# Altium project lv_io_project.PrjPCB (part 2 of 2)

## Sheet lv_io_lim.SchDoc
size A4; Organization: Badgerloop; Address1: 133 Engineering Research; Address2: Building; Address3: Madison, WI 53715
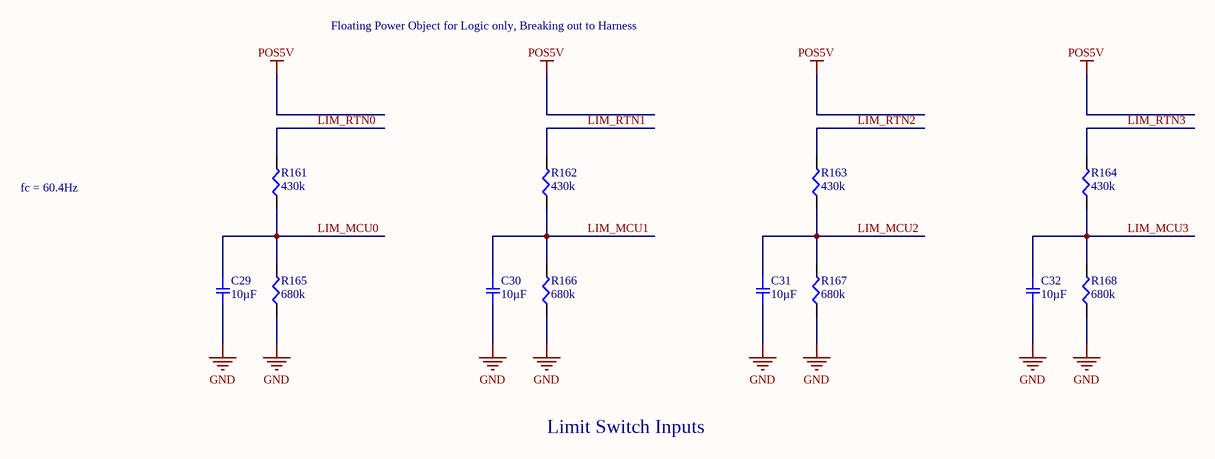
[diagram p8: lv_io_lim.SchDoc]

### Parts
C29  10µF  [SMD-0805C]
C30  10µF  [SMD-0805C]
C31  10µF  [SMD-0805C]
C32  10µF  [SMD-0805C]
R161  430k  [SMD-0402-RES]
R162  430k  [SMD-0402-RES]
R163  430k  [SMD-0402-RES]
R164  430k  [SMD-0402-RES]
R165  680k  [SMD-0402-RES]
R166  680k  [SMD-0402-RES]
R167  680k  [SMD-0402-RES]
R168  680k  [SMD-0402-RES]

### Nets
GND: C29.2 C30.2 C31.2 C32.2 R165.1 R166.1 R167.1 R168.1
LIM_MCU0: C29.1 R161.1 R165.2
LIM_MCU1: C30.1 R162.1 R166.2
LIM_MCU2: C31.1 R163.1 R167.2
LIM_MCU3: C32.1 R164.1 R168.2
LIM_RTN0: R161.2
LIM_RTN1: R162.2
LIM_RTN2: R163.2
LIM_RTN3: R164.2

### Notes on the sheet
- Floating Power Object for Logic only, Breaking out to Harness
- fc = 60.4Hz
- Limit Switch Inputs
- Title
- Size:
- Date:
- A4
- Number:
- Time:
- Revision:
- Sheet
- of
- File:

### Library data of the parts
C29-C32 = GRM21BC81E106KE51L: CAP CER 10UF 25V X6S 0805; Manufacturer: Murata Electronics North America; Factory Stock: 0; Unit Price (USD): 0.25; Minimum Quantity: 1; Tolerance: ±10%; Datasheets: http://www.murata.com/~/media/webrenewal/support/library/catalog/products/capacitor/mlcc/c02e.pdf; Image: //media.digikey.com/Renders/Murata%20Renders/0805%20(2012%20Metric)%20.85mm.jpg; Digi-Key Part Number: 490-10502-1-ND; Part Number: GRM21BC81E106KE51L; Quantity Available: 230; @ qty: 0; Packaging: Cut Tape (CT); Series: GRM; Part Status: Active; Value: 10µF; Voltage: 25V; Temperature Coefficient: X6S; Operating Temperature: -55°C ~ 105°C; Features: Derating Recommended; Ratings: -; Applications: General Purpose; Mounting Type: Surface Mount, MLCC; Package / Case: 0805 (2012 Metric); Size / Dimension: 0.079" L x 0.049" W (2.00mm x 1.25mm); Height - Seated (Max): -; Thickness (Max): 0.055" (1.40mm); Lead Spacing: -; Lead Style: -
R161-R164 = ERJ-2GEJ434X: RES SMD 430K OHM 5% 1/10W 0402; Manufacturer: Panasonic Electronic Components; Factory Stock: 0; Unit Price (USD): 0.00350; @ qty: 1500; Minimum Quantity: 1; Power (Watts): 0.1W, 1/10W; Temperature Coefficient: ±200ppm/°C; Part Number: ERJ-2GEJ434X; Datasheets: http://industrial.panasonic.com/www-cgi/jvcr13pz.cgi?E+PZ+3+AOA0001+ERJ2GEJ434X+7+WW; Image: //media.digikey.com/Photos/Panasonic%20Photos/ERJ-PA2-Series.jpg; Digi-Key Part Number: P430KJCT-ND; Quantity Available: 99138; Packaging: Cut Tape (CT); Series: ERJ; Part Status: Active; Value: 430k; Tolerance: ±5%; Composition: Thick Film; Features: Automotive AEC-Q200; Operating Temperature: -55°C ~ 155°C; Package / Case: 0402 (1005 Metric); Supplier Device Package: 0402; Size / Dimension: 0.039" L x 0.020" W (1.00mm x 0.50mm); Height - Seated (Max): 0.016" (0.40mm); Number of Terminations: 2; Failure Rate: -
R165-R168 = ERJ-2GEJ684X: RES SMD 680K OHM 5% 1/10W 0402; Manufacturer: Panasonic Electronic Components; Factory Stock: 0; Unit Price (USD): 0.00350; @ qty: 1500; Minimum Quantity: 1; Power (Watts): 0.1W, 1/10W; Temperature Coefficient: ±200ppm/°C; Part Number: ERJ-2GEJ684X; Datasheets: http://industrial.panasonic.com/www-cgi/jvcr13pz.cgi?E+PZ+3+AOA0001+ERJ2GEJ684X+7+WW; Image: //media.digikey.com/Photos/Panasonic%20Photos/ERJ-PA2-Series.jpg; Digi-Key Part Number: P680KJCT-ND; Quantity Available: 77606; Packaging: Cut Tape (CT); Series: ERJ; Part Status: Active; Value: 680k; Tolerance: ±5%; Composition: Thick Film; Features: Automotive AEC-Q200; Operating Temperature: -55°C ~ 155°C; Package / Case: 0402 (1005 Metric); Supplier Device Package: 0402; Size / Dimension: 0.039" L x 0.020" W (1.00mm x 0.50mm); Height - Seated (Max): 0.016" (0.40mm); Number of Terminations: 2; Failure Rate: -

## Nets that join several sheets
GND: lv_io_main_connector (23 pins), lv_io_accel (23 pins), lv_io_harness (36 pins), lv_io_retro (7 pins), lv_io_pressure (13 pins), lv_io_solenoid_ctl (13 pins), lv_io_solenoid_drv (16 pins), lv_io_analog_input (21 pins), lv_io_lim (8 pins)
POS3V3: lv_io_main_connector (12 pins), lv_io_accel (12 pins), lv_io_retro (12 pins)
POS5V: lv_io_main_connector (6 pins), lv_io_accel (C1.1 P1.1), lv_io_harness (5 pins), lv_io_pressure (13 pins), lv_io_solenoid_ctl (13 pins), lv_io_analog_input (13 pins)
POS24V: lv_io_harness (19 pins), lv_io_retro (13 pins), lv_io_pressure (8 pins), lv_io_solenoid_drv (9 pins), lv_io_analog_input (8 pins)
ANALOG_HRN_EXC0: lv_io_harness (J2.13), lv_io_analog_input (R113.1 R114.1)
ANALOG_HRN_EXC1: lv_io_harness (J2.25), lv_io_analog_input (R115.1 R116.1)
ANALOG_HRN_EXC2: lv_io_harness (J2.12), lv_io_analog_input (R117.1 R118.1)
ANALOG_HRN_EXC3: lv_io_harness (J2.24), lv_io_analog_input (R119.1 R120.1)
ANALOG_HRN_EXC4: lv_io_harness (J2.11), lv_io_analog_input (R129.1 R130.1)
ANALOG_HRN_EXC5: lv_io_harness (J2.23), lv_io_analog_input (R131.1 R132.1)
ANALOG_HRN_EXC6: lv_io_harness (J2.10), lv_io_analog_input (R133.1 R134.1)
ANALOG_HRN_EXC7: lv_io_harness (J2.22), lv_io_analog_input (R135.1 R136.1)
ANALOG_HRN_IN0: lv_io_harness (J2.9), lv_io_analog_input (R121.1 R189.1)
ANALOG_HRN_IN1: lv_io_harness (J2.21), lv_io_analog_input (R122.1 R190.1)
ANALOG_HRN_IN2: lv_io_harness (J2.8), lv_io_analog_input (R123.1 R191.1)
ANALOG_HRN_IN3: lv_io_harness (J2.20), lv_io_analog_input (R124.1 R192.1)
ANALOG_HRN_IN4: lv_io_harness (J2.7), lv_io_analog_input (R137.1 R197.1)
ANALOG_HRN_IN5: lv_io_harness (J2.19), lv_io_analog_input (R138.1 R198.1)
ANALOG_HRN_IN6: lv_io_harness (J2.6), lv_io_analog_input (R139.1 R199.1)
ANALOG_HRN_IN7: lv_io_harness (J2.18), lv_io_analog_input (R140.1 R200.1)
I2C2_SCL: lv_io_main_connector (J6.4 R26.2), lv_io_accel (R3.1 R16.2 R17.2), lv_io_pressure (R69.1), lv_io_solenoid_ctl (R100.1), lv_io_analog_input (R153.1)
I2C2_SDA: lv_io_main_connector (J6.20 R27.2), lv_io_accel (R4.1 R18.2 R19.2), lv_io_pressure (R66.1), lv_io_solenoid_ctl (R101.1), lv_io_analog_input (R150.1)
LIM_MCU0: lv_io_solenoid_ctl (U11.21), lv_io_lim (C29.1 R161.1 R165.2)
LIM_MCU1: lv_io_solenoid_ctl (U11.22), lv_io_lim (C30.1 R162.1 R166.2)
LIM_MCU2: lv_io_solenoid_ctl (U11.23), lv_io_lim (C31.1 R163.1 R167.2)
LIM_MCU3: lv_io_solenoid_ctl (U11.24), lv_io_lim (C32.1 R164.1 R168.2)
LIM_RTN0: lv_io_harness (J3.1), lv_io_lim (R161.2)
LIM_RTN1: lv_io_harness (J3.14), lv_io_lim (R162.2)
LIM_RTN2: lv_io_harness (J3.2), lv_io_lim (R163.2)
LIM_RTN3: lv_io_harness (J3.15), lv_io_lim (R164.2)
PS_HRN_EXC0: lv_io_harness (J4.13), lv_io_pressure (R29.1 R30.1)
PS_HRN_EXC1: lv_io_harness (J4.25), lv_io_pressure (R31.1 R32.1)
PS_HRN_EXC2: lv_io_harness (J4.12), lv_io_pressure (R33.1 R34.1)
PS_HRN_EXC3: lv_io_harness (J4.24), lv_io_pressure (R35.1 R36.1)
PS_HRN_EXC4: lv_io_harness (J4.11), lv_io_pressure (R45.1 R46.1)
PS_HRN_EXC5: lv_io_harness (J4.23), lv_io_pressure (R47.1 R48.1)
PS_HRN_EXC6: lv_io_harness (J4.10), lv_io_pressure (R49.1 R50.1)
PS_HRN_EXC7: lv_io_harness (J4.22), lv_io_pressure (R51.1 R52.1 R64.2), lv_io_analog_input (R148.2)
PS_HRN_IN0: lv_io_harness (J4.9), lv_io_pressure (R37.1 R173.1)
PS_HRN_IN1: lv_io_harness (J4.21), lv_io_pressure (R38.1 R174.1)
PS_HRN_IN2: lv_io_harness (J4.8), lv_io_pressure (R39.1 R175.1)
PS_HRN_IN3: lv_io_harness (J4.20), lv_io_pressure (R40.1 R176.1)
PS_HRN_IN4: lv_io_harness (J4.7), lv_io_pressure (R53.1 R181.1)
PS_HRN_IN5: lv_io_harness (J4.19), lv_io_pressure (R54.1 R182.1)
PS_HRN_IN6: lv_io_harness (J4.6), lv_io_pressure (R55.1 R183.1)
PS_HRN_IN7: lv_io_harness (J4.18), lv_io_pressure (R56.1 R67.2 R184.1), lv_io_analog_input (R151.2)
RETRO_SIG0: lv_io_harness (J1.23), lv_io_retro (D12.1 U10.2)
RETRO_SIG1: lv_io_harness (J1.11), lv_io_retro (D10.1 U9.2)
RETRO_SIG2: lv_io_harness (J1.24), lv_io_retro (D8.1 U8.2)
RETRO_SIG3: lv_io_harness (J1.12), lv_io_retro (D6.1 U7.2)
RETRO_SIG4: lv_io_harness (J1.25), lv_io_retro (D4.1 U6.2)
RETRO_SIG5: lv_io_harness (J1.13), lv_io_retro (D2.1 R81.2 U5.2)
SOL_GATE0: lv_io_solenoid_ctl (D20.1 D28.2 U11.1), lv_io_solenoid_drv (Q1.1 R105.2)
SOL_GATE1: lv_io_solenoid_ctl (D19.1 D27.2 U11.2), lv_io_solenoid_drv (Q2.1 R106.2)
SOL_GATE2: lv_io_solenoid_ctl (D18.1 D26.2 U11.3), lv_io_solenoid_drv (Q3.1 R107.2)
SOL_GATE3: lv_io_solenoid_ctl (D17.1 D25.2 U11.4), lv_io_solenoid_drv (Q4.1 R108.2)
SOL_GATE4: lv_io_solenoid_ctl (D16.1 D24.2 U11.5), lv_io_solenoid_drv (Q5.1 R109.2)
SOL_GATE5: lv_io_solenoid_ctl (D15.1 D23.2 U11.6), lv_io_solenoid_drv (Q6.1 R110.2)
SOL_GATE6: lv_io_solenoid_ctl (D14.1 D22.2 U11.7), lv_io_solenoid_drv (Q7.1 R111.2)
SOL_GATE7: lv_io_solenoid_ctl (D13.1 D21.2 U11.8), lv_io_solenoid_drv (Q8.1 R112.2)
SOL_RTN0: lv_io_harness (J3.9), lv_io_solenoid_drv (D29.1 Q1.4)
SOL_RTN1: lv_io_harness (J3.21), lv_io_solenoid_drv (D30.1 Q2.4)
SOL_RTN2: lv_io_harness (J3.8), lv_io_solenoid_drv (D31.1 Q3.4)
SOL_RTN3: lv_io_harness (J3.20), lv_io_solenoid_drv (D32.1 Q4.4)
SOL_RTN4: lv_io_harness (J3.7), lv_io_solenoid_drv (D33.1 Q5.4)
SOL_RTN5: lv_io_harness (J3.19), lv_io_solenoid_drv (D34.1 Q6.4)
SOL_RTN6: lv_io_harness (J3.6), lv_io_solenoid_drv (D35.1 Q7.4)
SOL_RTN7: lv_io_harness (J3.18), lv_io_solenoid_drv (D36.1 P21.2 Q8.4)